# Altium schematic sheet RF Communication Board.SchDoc
size A
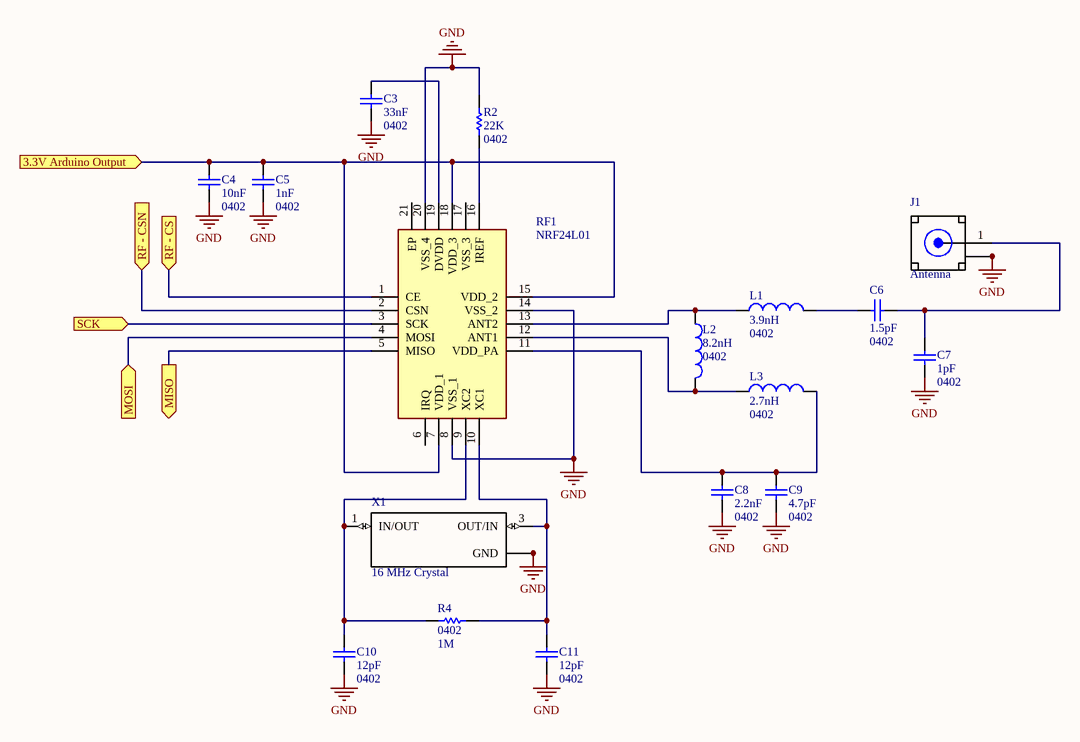
[diagram p0: RF Communication Board.SchDoc]

## Parts
C3  33nF  value 0402  [SMD-0402C]
C4  10nF  value 0402  [SMD-0402C]
C5  1nF  value 0402  [SMD-0402C]
C6  1.5pF  value 0402  [SMD-0402C]
C7  1pF  value 0402  [SMD-0402C]
C8  2.2nF  value 0402  [SMD-0402C]
C9  4.7pF  value 0402  [SMD-0402C]
C10  12pF  value 0402  [SMD-0402C]
C11  12pF  value 0402  [SMD-0402C]
J1  Antenna  [*SAMTEC_SMA-J-P-H-RA-TH1]
L1  3.9nH  value 0402  [0402-A]
L2  8.2nH  value 0402  [0402-A]
L3  2.7nH  value 0402  [0402-A]
R2  22K  value 0402  [SMD-0402-RES]
R4  0402  value 1M  [SMD-0402-RES]
RF1  NRF24L01  [QFN50P400X400X95-21N-D]
X1  16 MHz Crystal  [*XTAL_ECS-160-12-30BQ-AEN-TR]

## Ports
3.3V Arduino Output (in), MISO (out), MOSI (in), RF - CS (in), RF - CSN (in), SCK (in)

## Nets
GND: C3.1 C4.1 C5.1 C7.1 C8.1 C9.1 C10.1 C11.1 J1.2(GND) J1.3(GND) J1.4(GND) J1.5(GND) R2.2 RF1.8(VSS_1) RF1.14(VSS_2) RF1.20(VSS_4) X1.2(GND) X1.4(GND)
3.3V Arduino Output: C4.2 C5.2 RF1.7(VDD_1) RF1.15(VDD_2) RF1.18(VDD_3) ; port 3.3V Arduino Output
MISO: RF1.5(MISO) ; port MISO
MOSI: RF1.4(MOSI) ; port MOSI
RF - CS: RF1.1(CE) ; port RF - CS
RF - CSN: RF1.2(CSN) ; port RF - CSN
SCK: RF1.3(SCK) ; port SCK
NetC3_2: C3.2 RF1.19(DVDD)
NetC6_1: C6.1 L1.2
NetC6_2: C6.2 C7.2 J1.1(SIGNAL)
NetC8_2: C8.2 C9.2 L3.2 RF1.11(VDD_PA)
NetC10_2: C10.2 R4.2 RF1.9(XC2) X1.1(IN/OUT)
NetC11_2: C11.2 R4.1 RF1.10(XC1) X1.3(OUT/IN)
NetL1_1: L1.1 L2.1 RF1.13(ANT2)
NetL2_2: L2.2 L3.1 RF1.12(ANT1)
NetR2_1: R2.1 RF1.16(IREF)

Not connected (* = marked no-connect by the designer): RF1 6(IRQ) 17(VSS_3) 21(EP)

## Library data of the parts
C3-C11 = Cap: Capacitor; Published: 8-Jun-2000; LatestRevisionDate: 17-Jul-2002; LatestRevisionNote: Re-released for DXP Platform.; PackageReference: RAD-0.3; Publisher: Altium Limited; PackageDescription: Radial Cap, Thru-Hole; 2 Leads; 0.3 in Pin Spacing
J1 = SMA-J-P-H-RA-TH1: SMA Connector Jack, Female Socket 50Ohm Through Hole, Right Angle Solder; MF: Samtec; SnapEDA_Link: https://www.snapeda.com/parts/SMA-J-P-H-RA-TH1/Samtec%20Inc./view-part/134498/?ref=snap; Availability: Unavailable; MP: SMA-J-P-H-RA-TH1; Price: None; Package: None; Value: *
L1-L3 = Inductor: Code_IEC: 1005; Published: 8-Jun-2000; LatestRevisionDate: 29-May-2009; LatestRevisionNote: IPC-7351 Footprint Added.; PackageReference: 0402-A; Publisher: Altium Limited; PackageDescription: Chip Inductor; Code_JEITA: 0402
R2 R4 = Res1: Resistor; Published: 8-Jun-2000; LatestRevisionDate: 17-Jul-2002; LatestRevisionNote: Re-released for DXP Platform.; PackageReference: AXIAL-0.3; Publisher: Altium Limited; PackageDescription: Axial Device, Thru-Hole; 2 Leads; 0.3 in Pin Spacing
RF1 = NRF24L01: Integrated Circuit; Manufacturer_Name: Nordic Semiconductor; Datasheet Link: https://www.nordicsemi.com/chi/content/download/2730/34105/file/nRF24L01_Product_Specification_v2_0.pdf; Height: 0.95mm; Manufacturer_Part_Number: NRF24L01; Mouser Part Number: 949-NRF24L01; Mouser Price/Stock: https://www.mouser.com/Search/Refine.aspx?Keyword=949-NRF24L01; RS Part Number: 6156531; RS Price/Stock: http://uk.rs-online.com/web/p/products/6156531
X1 = ECS-160-12-30BQ-AEN-TR: / 16MHz Â±25ppm Crystal 12pF 50 Ohms 4-SMD, No Lead /; MF: ECS Inc.; Availability: Unavailable; SnapEDA_Link: https://www.snapeda.com/parts/ECS-160-12-30BQ-AEN-TR/ECS%20Inc./view-part/2749540/?ref=snap; MP: ECS-160-12-30BQ-AEN-TR; Price: None; Package: SMD-4 ECS International; Value: *